# Altium schematic sheet HPCC_Connector_B.SchDoc: HPCC Connector B
size B; CheckedBy: Jason Sullins; Author: Jordan Harris-Toovy; Revision: 0.2; SheetNumber: 9; SheetTotal: 22; Size: ANSI B
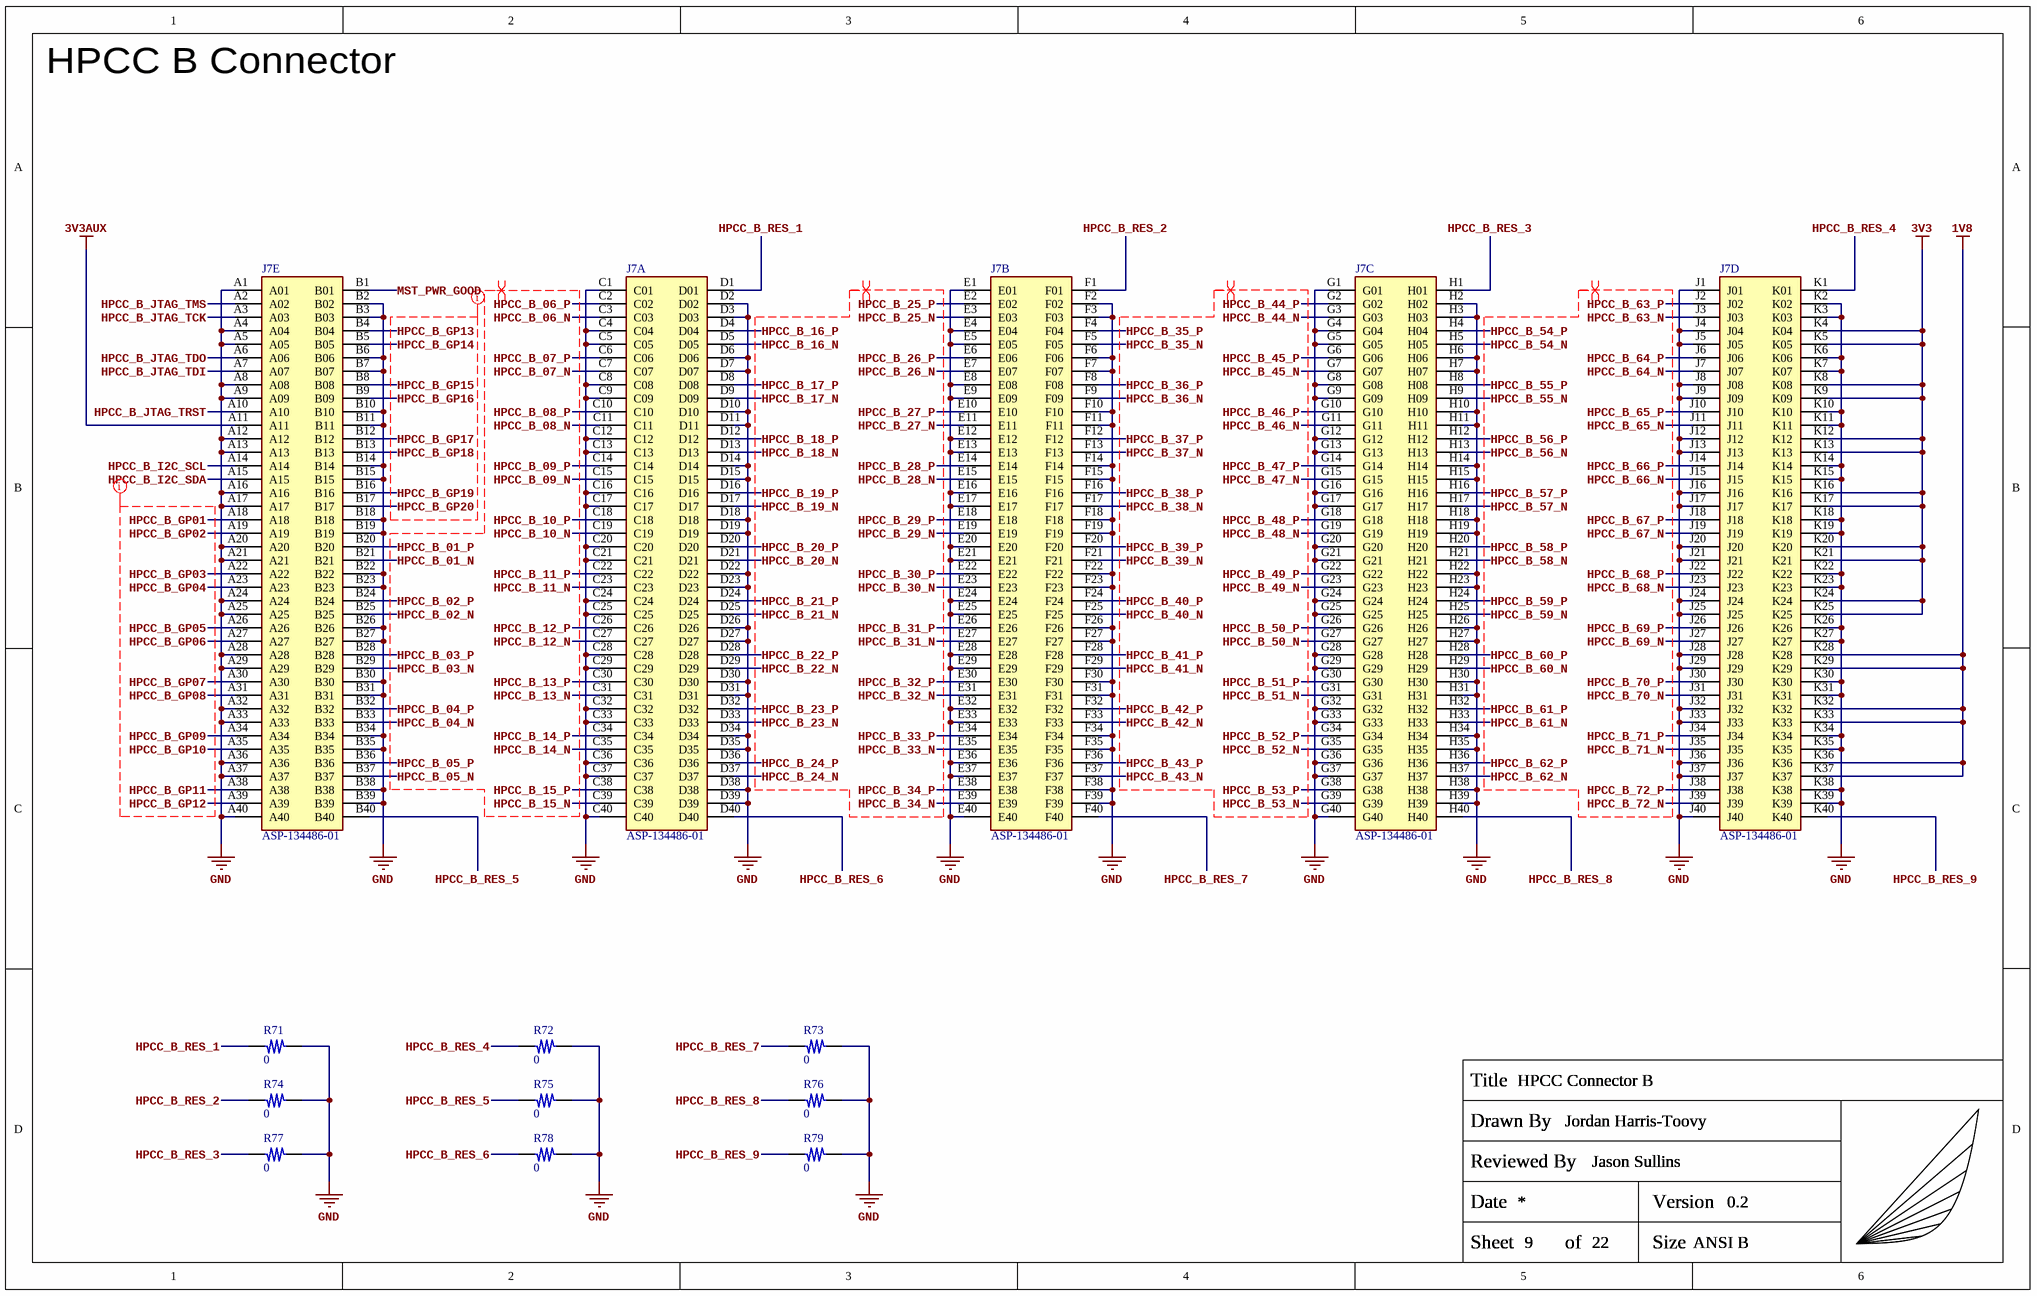
[diagram p0: HPCC_Connector_B.SchDoc]

## Parts
J7  ASP-134486-01  [SAMTEC_ASP-134486-01]  (parts A,B,C,D,E of 5)
R71  0  [R_0402_Generic]
R72  0  [R_0402_Generic]
R73  0  [R_0402_Generic]
R74  0  [R_0402_Generic]
R75  0  [R_0402_Generic]
R76  0  [R_0402_Generic]
R77  0  [R_0402_Generic]
R78  0  [R_0402_Generic]
R79  0  [R_0402_Generic]
TITLEBLOCK?  Capstone_Title_Block  (value not drawn)  (graphical)

## Nets
1V8: J7.K28 J7.K29 J7.K32 J7.K33 J7.K36 J7.K37
3V3: J7.K4(K04) J7.K5(K05) J7.K8(K08) J7.K9(K09) J7.K12 J7.K13 J7.K16 J7.K17 J7.K20 J7.K21 J7.K24 J7.K25
3V3AUX: J7.A11
GND: J7.A1(A01) J7.A4(A04) J7.A5(A05) J7.A8(A08) J7.A9(A09) J7.A12 J7.A13 J7.A16 J7.A17 J7.A20 J7.A21 J7.A24 J7.A25 J7.A28 J7.A29 J7.A32 J7.A33 J7.A36 J7.A37 J7.A40 J7.B2(B02) J7.B3(B03) J7.B6(B06) J7.B7(B07) J7.B10 J7.B11 J7.B14 J7.B15 J7.B18 J7.B19 J7.B22 J7.B23 J7.B26 J7.B27 J7.B30 J7.B31 J7.B34 J7.B35 J7.B38 J7.B39 J7.C1(C01) J7.C4(C04) J7.C5(C05) J7.C8(C08) J7.C9(C09) J7.C12 J7.C13 J7.C16 J7.C17 J7.C20 J7.C21 J7.C24 J7.C25 J7.C28 J7.C29 J7.C32 J7.C33 J7.C36 J7.C37 J7.C40 J7.D2(D02) J7.D3(D03) J7.D6(D06) J7.D7(D07) J7.D10 J7.D11 J7.D14 J7.D15 J7.D18 J7.D19 J7.D22 J7.D23 J7.D26 J7.D27 J7.D30 J7.D31 J7.D34 J7.D35 J7.D38 J7.D39 J7.E1(E01) J7.E4(E04) J7.E5(E05) J7.E8(E08) J7.E9(E09) J7.E12 J7.E13 J7.E16 J7.E17 J7.E20 J7.E21 J7.E24 J7.E25 J7.E28 J7.E29 J7.E32 J7.E33 J7.E36 J7.E37 J7.E40 J7.F2(F02) J7.F3(F03) J7.F6(F06) J7.F7(F07) J7.F10 J7.F11 J7.F14 J7.F15 J7.F18 J7.F19 J7.F22 J7.F23 J7.F26 J7.F27 J7.F30 J7.F31 J7.F34 J7.F35 J7.F38 J7.F39 J7.G1(G01) J7.G4(G04) J7.G5(G05) J7.G8(G08) J7.G9(G09) J7.G12 J7.G13 J7.G16 J7.G17 J7.G20 J7.G21 J7.G24 J7.G25 J7.G28 J7.G29 J7.G32 J7.G33 J7.G36 J7.G37 J7.G40 J7.H2(H02) J7.H3(H03) J7.H6(H06) J7.H7(H07) J7.H10 J7.H11 J7.H14 J7.H15 J7.H18 J7.H19 J7.H22 J7.H23 J7.H26 J7.H27 J7.H30 J7.H31 J7.H34 J7.H35 J7.H38 J7.H39 J7.J1(J01) J7.J4(J04) J7.J5(J05) J7.J8(J08) J7.J9(J09) J7.J12 J7.J13 J7.J16 J7.J17 J7.J20 J7.J21 J7.J24 J7.J25 J7.J28 J7.J29 J7.J32 J7.J33 J7.J36 J7.J37 J7.J40 J7.K2(K02) J7.K3(K03) J7.K6(K06) J7.K7(K07) J7.K10 J7.K11 J7.K14 J7.K15 J7.K18 J7.K19 J7.K22 J7.K23 J7.K26 J7.K27 J7.K30 J7.K31 J7.K34 J7.K35 J7.K38 J7.K39 R71.1 R72.1 R73.1 R74.1 R75.1 R76.1 R77.1 R78.1 R79.1
HPCC_B_01_N: J7.B21
HPCC_B_01_P: J7.B20
HPCC_B_02_N: J7.B25
HPCC_B_02_P: J7.B24
HPCC_B_03_N: J7.B29
HPCC_B_03_P: J7.B28
HPCC_B_04_N: J7.B33
HPCC_B_04_P: J7.B32
HPCC_B_05_N: J7.B37
HPCC_B_05_P: J7.B36
HPCC_B_06_N: J7.C3(C03)
HPCC_B_06_P: J7.C2(C02)
HPCC_B_07_N: J7.C7(C07)
HPCC_B_07_P: J7.C6(C06)
HPCC_B_08_N: J7.C11
HPCC_B_08_P: J7.C10
HPCC_B_09_N: J7.C15
HPCC_B_09_P: J7.C14
HPCC_B_10_N: J7.C19
HPCC_B_10_P: J7.C18
HPCC_B_11_N: J7.C23
HPCC_B_11_P: J7.C22
HPCC_B_12_N: J7.C27
HPCC_B_12_P: J7.C26
HPCC_B_13_N: J7.C31
HPCC_B_13_P: J7.C30
HPCC_B_14_N: J7.C35
HPCC_B_14_P: J7.C34
HPCC_B_15_N: J7.C39
HPCC_B_15_P: J7.C38
HPCC_B_16_N: J7.D5(D05)
HPCC_B_16_P: J7.D4(D04)
HPCC_B_17_N: J7.D9(D09)
HPCC_B_17_P: J7.D8(D08)
HPCC_B_18_N: J7.D13
HPCC_B_18_P: J7.D12
HPCC_B_19_N: J7.D17
HPCC_B_19_P: J7.D16
HPCC_B_20_N: J7.D21
HPCC_B_20_P: J7.D20
HPCC_B_21_N: J7.D25
HPCC_B_21_P: J7.D24
HPCC_B_22_N: J7.D29
HPCC_B_22_P: J7.D28
HPCC_B_23_N: J7.D33
HPCC_B_23_P: J7.D32
HPCC_B_24_N: J7.D37
HPCC_B_24_P: J7.D36
HPCC_B_25_N: J7.E3(E03)
HPCC_B_25_P: J7.E2(E02)
HPCC_B_26_N: J7.E7(E07)
HPCC_B_26_P: J7.E6(E06)
HPCC_B_27_N: J7.E11
HPCC_B_27_P: J7.E10
HPCC_B_28_N: J7.E15
HPCC_B_28_P: J7.E14
HPCC_B_29_N: J7.E19
HPCC_B_29_P: J7.E18
HPCC_B_30_N: J7.E23
HPCC_B_30_P: J7.E22
HPCC_B_31_N: J7.E27
HPCC_B_31_P: J7.E26
HPCC_B_32_N: J7.E31
HPCC_B_32_P: J7.E30
HPCC_B_33_N: J7.E35
HPCC_B_33_P: J7.E34
HPCC_B_34_N: J7.E39
HPCC_B_34_P: J7.E38
HPCC_B_35_N: J7.F5(F05)
HPCC_B_35_P: J7.F4(F04)
HPCC_B_36_N: J7.F9(F09)
HPCC_B_36_P: J7.F8(F08)
HPCC_B_37_N: J7.F13
HPCC_B_37_P: J7.F12
HPCC_B_38_N: J7.F17
HPCC_B_38_P: J7.F16
HPCC_B_39_N: J7.F21
HPCC_B_39_P: J7.F20
HPCC_B_40_N: J7.F25
HPCC_B_40_P: J7.F24
HPCC_B_41_N: J7.F29
HPCC_B_41_P: J7.F28
HPCC_B_42_N: J7.F33
HPCC_B_42_P: J7.F32
HPCC_B_43_N: J7.F37
HPCC_B_43_P: J7.F36
HPCC_B_44_N: J7.G3(G03)
HPCC_B_44_P: J7.G2(G02)
HPCC_B_45_N: J7.G7(G07)
HPCC_B_45_P: J7.G6(G06)
HPCC_B_46_N: J7.G11
HPCC_B_46_P: J7.G10
HPCC_B_47_N: J7.G15
HPCC_B_47_P: J7.G14
HPCC_B_48_N: J7.G19
HPCC_B_48_P: J7.G18
HPCC_B_49_N: J7.G23
HPCC_B_49_P: J7.G22
HPCC_B_50_N: J7.G27
HPCC_B_50_P: J7.G26
HPCC_B_51_N: J7.G31
HPCC_B_51_P: J7.G30
HPCC_B_52_N: J7.G35
HPCC_B_52_P: J7.G34
HPCC_B_53_N: J7.G39
HPCC_B_53_P: J7.G38
HPCC_B_54_N: J7.H5(H05)
HPCC_B_54_P: J7.H4(H04)
HPCC_B_55_N: J7.H9(H09)
HPCC_B_55_P: J7.H8(H08)
HPCC_B_56_N: J7.H13
HPCC_B_56_P: J7.H12
HPCC_B_57_N: J7.H17
HPCC_B_57_P: J7.H16
HPCC_B_58_N: J7.H21
HPCC_B_58_P: J7.H20
HPCC_B_59_N: J7.H25
HPCC_B_59_P: J7.H24
HPCC_B_60_N: J7.H29
HPCC_B_60_P: J7.H28
HPCC_B_61_N: J7.H33
HPCC_B_61_P: J7.H32
HPCC_B_62_N: J7.H37
HPCC_B_62_P: J7.H36
HPCC_B_63_N: J7.J3(J03)
HPCC_B_63_P: J7.J2(J02)
HPCC_B_64_N: J7.J7(J07)
HPCC_B_64_P: J7.J6(J06)
HPCC_B_65_N: J7.J11
HPCC_B_65_P: J7.J10
HPCC_B_66_N: J7.J15
HPCC_B_66_P: J7.J14
HPCC_B_67_N: J7.J19
HPCC_B_67_P: J7.J18
HPCC_B_68_N: J7.J23
HPCC_B_68_P: J7.J22
HPCC_B_69_N: J7.J27
HPCC_B_69_P: J7.J26
HPCC_B_70_N: J7.J31
HPCC_B_70_P: J7.J30
HPCC_B_71_N: J7.J35
HPCC_B_71_P: J7.J34
HPCC_B_72_N: J7.J39
HPCC_B_72_P: J7.J38
HPCC_B_GP01: J7.A18
HPCC_B_GP02: J7.A19
HPCC_B_GP03: J7.A22
HPCC_B_GP04: J7.A23
HPCC_B_GP05: J7.A26
HPCC_B_GP06: J7.A27
HPCC_B_GP07: J7.A30
HPCC_B_GP08: J7.A31
HPCC_B_GP09: J7.A34
HPCC_B_GP10: J7.A35
HPCC_B_GP11: J7.A38
HPCC_B_GP12: J7.A39
HPCC_B_GP13: J7.B4(B04)
HPCC_B_GP14: J7.B5(B05)
HPCC_B_GP15: J7.B8(B08)
HPCC_B_GP16: J7.B9(B09)
HPCC_B_GP17: J7.B12
HPCC_B_GP18: J7.B13
HPCC_B_GP19: J7.B16
HPCC_B_GP20: J7.B17
HPCC_B_I2C_SCL: J7.A14
HPCC_B_I2C_SDA: J7.A15
HPCC_B_JTAG_TCK: J7.A3(A03)
HPCC_B_JTAG_TDI: J7.A7(A07)
HPCC_B_JTAG_TDO: J7.A6(A06)
HPCC_B_JTAG_TMS: J7.A2(A02)
HPCC_B_JTAG_TRST: J7.A10
HPCC_B_RES_1: J7.D1(D01) R71.2
HPCC_B_RES_2: J7.F1(F01) R74.2
HPCC_B_RES_3: J7.H1(H01) R77.2
HPCC_B_RES_4: J7.K1(K01) R72.2
HPCC_B_RES_5: J7.B40 R75.2
HPCC_B_RES_6: J7.D40 R78.2
HPCC_B_RES_7: J7.F40 R73.2
HPCC_B_RES_8: J7.H40 R76.2
HPCC_B_RES_9: J7.K40 R79.2
MST_PWR_GOOD: J7.B1(B01)

## Layout directives
differential pair; differential pair class DP100_HPCC_B: HPCC_B_01_N, HPCC_B_01_P, HPCC_B_02_N, HPCC_B_02_P, HPCC_B_03_N, HPCC_B_03_P, HPCC_B_04_N, HPCC_B_04_P, HPCC_B_05_N, HPCC_B_05_P, HPCC_B_06_N, HPCC_B_06_P, HPCC_B_07_N, HPCC_B_07_P, HPCC_B_08_N, HPCC_B_08_P, HPCC_B_09_N, HPCC_B_09_P, HPCC_B_10_N, HPCC_B_10_P, HPCC_B_11_N, HPCC_B_11_P, HPCC_B_12_N, HPCC_B_12_P, HPCC_B_13_N, HPCC_B_13_P, HPCC_B_14_N, HPCC_B_14_P, HPCC_B_15_N, HPCC_B_15_P, HPCC_B_16_N, HPCC_B_16_P, HPCC_B_17_N, HPCC_B_17_P, HPCC_B_18_N, HPCC_B_18_P, HPCC_B_19_N, HPCC_B_19_P, HPCC_B_20_N, HPCC_B_20_P, HPCC_B_21_N, HPCC_B_21_P, HPCC_B_22_N, HPCC_B_22_P, HPCC_B_23_N, HPCC_B_23_P, HPCC_B_24_N, HPCC_B_24_P, HPCC_B_25_N, HPCC_B_25_P, HPCC_B_26_N, HPCC_B_26_P, HPCC_B_27_N, HPCC_B_27_P, HPCC_B_28_N, HPCC_B_28_P, HPCC_B_29_N, HPCC_B_29_P, HPCC_B_30_N, HPCC_B_30_P, HPCC_B_31_N, HPCC_B_31_P, HPCC_B_32_N, HPCC_B_32_P, HPCC_B_33_N, HPCC_B_33_P, HPCC_B_34_N, HPCC_B_34_P, HPCC_B_35_N, HPCC_B_35_P, HPCC_B_36_N, HPCC_B_36_P, HPCC_B_37_N, HPCC_B_37_P, HPCC_B_38_N, HPCC_B_38_P, HPCC_B_39_N, HPCC_B_39_P, HPCC_B_40_N, HPCC_B_40_P, HPCC_B_41_N, HPCC_B_41_P, HPCC_B_42_N, HPCC_B_42_P, HPCC_B_43_N, HPCC_B_43_P, HPCC_B_44_N, HPCC_B_44_P, HPCC_B_45_N, HPCC_B_45_P, HPCC_B_46_N, HPCC_B_46_P, HPCC_B_47_N, HPCC_B_47_P, HPCC_B_48_N, HPCC_B_48_P, HPCC_B_49_N, HPCC_B_49_P, HPCC_B_50_N, HPCC_B_50_P, HPCC_B_51_N, HPCC_B_51_P, HPCC_B_52_N, HPCC_B_52_P, HPCC_B_53_N, HPCC_B_53_P, HPCC_B_54_N, HPCC_B_54_P, HPCC_B_55_N, HPCC_B_55_P, HPCC_B_56_N, HPCC_B_56_P, HPCC_B_57_N, HPCC_B_57_P, HPCC_B_58_N, HPCC_B_58_P, HPCC_B_59_N, HPCC_B_59_P, HPCC_B_60_N, HPCC_B_60_P, HPCC_B_61_N, HPCC_B_61_P, HPCC_B_62_N, HPCC_B_62_P, HPCC_B_63_N, HPCC_B_63_P, HPCC_B_64_N, HPCC_B_64_P, HPCC_B_65_N, HPCC_B_65_P, HPCC_B_66_N, HPCC_B_66_P, HPCC_B_67_N, HPCC_B_67_P, HPCC_B_68_N, HPCC_B_68_P, HPCC_B_69_N, HPCC_B_69_P, HPCC_B_70_N, HPCC_B_70_P, HPCC_B_71_N, HPCC_B_71_P, HPCC_B_72_N, HPCC_B_72_P
net class SE50_HPCC_B: HPCC_B_GP01, HPCC_B_GP02, HPCC_B_GP03, HPCC_B_GP04, HPCC_B_GP05, HPCC_B_GP06, HPCC_B_GP07, HPCC_B_GP08, HPCC_B_GP09, HPCC_B_GP10, HPCC_B_GP11, HPCC_B_GP12, HPCC_B_GP13, HPCC_B_GP14, HPCC_B_GP15, HPCC_B_GP16, HPCC_B_GP17, HPCC_B_GP18, HPCC_B_GP19, HPCC_B_GP20

## Notes on the sheet
- HPCC B Connector
- (in symbol Capstone_Title_Block) Title; Drawn By; Reviewed By; Date; Version; Sheet; of; Size

## Library data of the parts
J7 = ASP-134486-01: 400 Position Connector Array, Female Sockets Surface Mount Gold; Manufacturer: Samtec; Manufacturer Part Number: ASP-134486-01
R71-R79 = ERJ-2GE0R00X: Jumper 0Ohm SMD resistor in 0402 size; Manufacturer: Panasonic; Manufacturer Part Number: ERJ-2GE0R00X
TITLEBLOCK? = Capstone_Title_Block: Custom title block with personal logo; Manufacturer: NONE; Manufacturer Part Number: NONE